# EAGLE design FSQCallTelemetry (EAGLE 7.6.0)
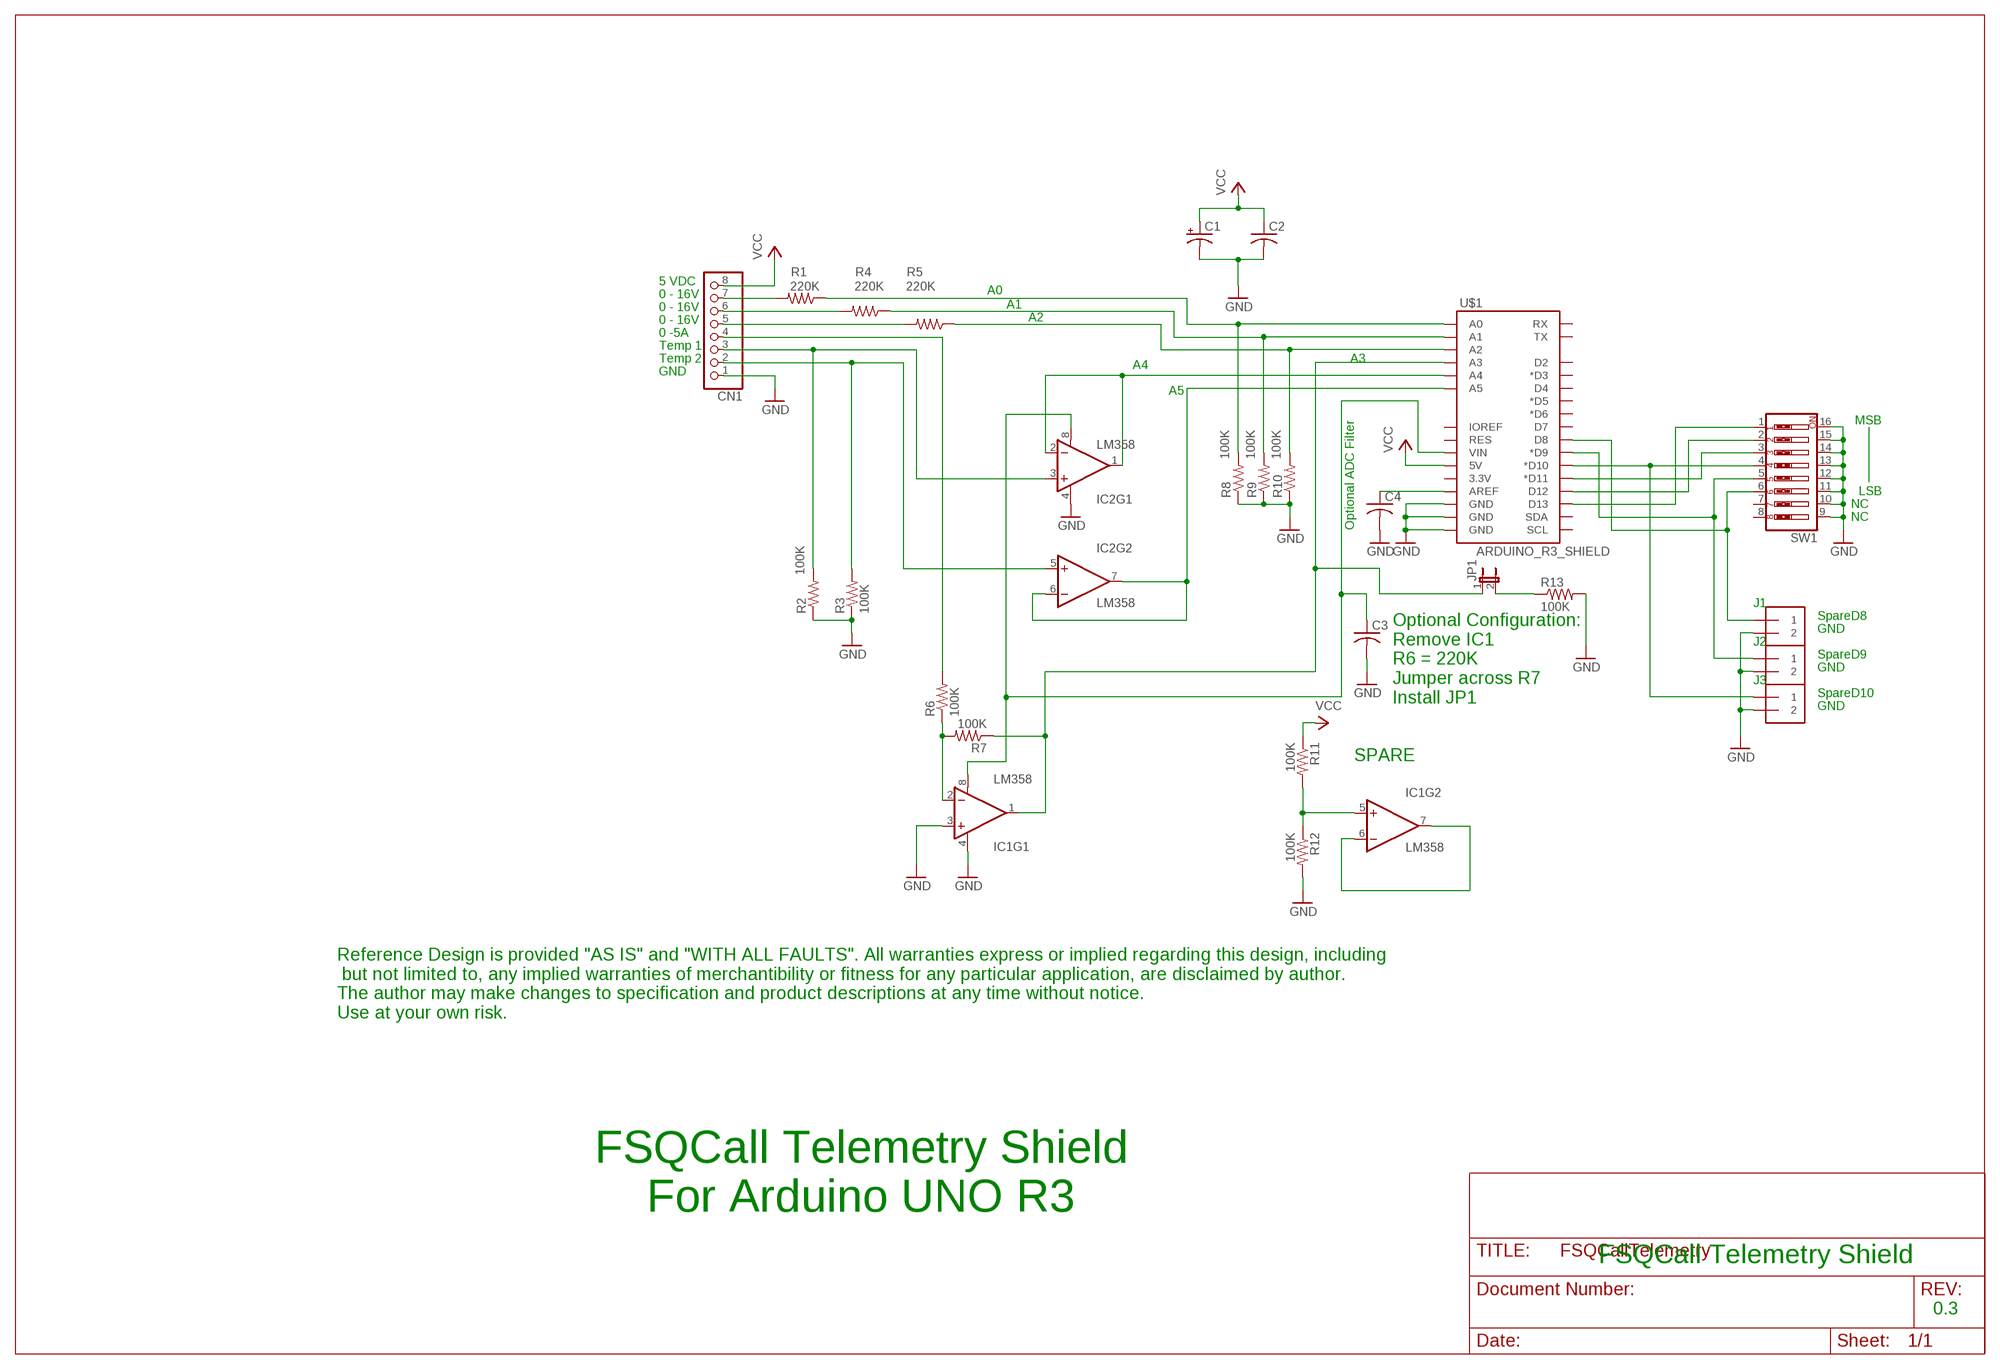
[diagram p0: schematic, sheet 1]

## Parts
C1  CPOL-USTT6D6  [TT5D6]
C2  C-US050-025X075  [C050-025X075]
C3  C-US050-025X075  [C050-025X075]
C4  C-US050-025X075  [C050-025X075]
CN1  PINHD-1X8BIG  [1X08-BIG]
IC1  LM358  [DIP08]
IC2  LM358  [DIP08]
J1  1X2-3.5MM  [1X2-3.5MM]
J2  1X2-3.5MM  [1X2-3.5MM]
J3  1X2-3.5MM  [1X2-3.5MM]
JP1  JP1E  [JP1]
R1  220K  R-US_0207/10  [0207/10]
R2  100K  R-US_0207/10  [0207/10]
R3  100K  R-US_0207/10  [0207/10]
R4  220K  R-US_0207/10  [0207/10]
R5  220K  R-US_0207/10  [0207/10]
R6  100K  R-US_0207/10  [0207/10]
R7  100K  R-US_0207/10  [0207/10]
R8  100K  R-US_0207/10  [0207/10]
R9  100K  R-US_0207/10  [0207/10]
R10  100K  R-US_0207/10  [0207/10]
R11  100K  R-US_0207/10  [0207/10]
R12  100K  R-US_0207/10  [0207/10]
R13  100K  R-US_0207/10  [0207/10]
SW1  SW_DIP-8  [DIPSWITCH-08]
U$1  ARDUINO_R3_SHIELD  [UNO_R3_SHIELD]

## Nets
GND: C1.- C2.2 C3.2 C4.2 CN1.1 IC1.3(+IN) IC1.4(V-) IC2.4(V-) J1.2 J2.2 J3.2 R2.1 R3.1 R8.1 R9.1 R10.1 R12.2 R13.2 SW1.9 SW1.10 SW1.11 SW1.12 SW1.13 SW1.14 SW1.15 SW1.16 U$1.GND@0(GND) U$1.GND@1(GND) U$1.GND@2(GND)
N$1: CN1.2 IC2.5(+IN) R3.2
N$2: IC1.2(-IN) R6.1 R7.2
N$3: CN1.3 IC2.3(+IN) R2.2
N$4: IC2.6(-IN) IC2.7(OUT) U$1.A5
N$5: CN1.4 R6.2
N$6: C3.1 IC1.8(V+) IC2.8(V+) U$1.VIN
N$7: C4.1 U$1.AREF
N$8: SW1.1 U$1.D13
N$9: CN1.7 R1.2
N$10: R1.1 R8.2 U$1.A0
N$11: R4.1 R9.2 U$1.A1
N$12: R5.1 R10.2 U$1.A2
N$13: SW1.2 U$1.D12
N$14: IC1.1(OUT) JP1.1 R7.1 U$1.A3
N$15: IC2.1(OUT) IC2.2(-IN) U$1.A4
N$16: SW1.3 U$1.D11(*D11)
N$17: J3.1 SW1.4 U$1.D10(*D10)
N$18: J2.1 SW1.5 U$1.D9(*D9)
N$19: IC1.5(+IN) R11.2 R12.1
N$20: IC1.6(-IN) IC1.7(OUT)
N$21: J1.1 SW1.6 U$1.D8
N$23: CN1.6 R4.2
N$24: CN1.5 R5.2
N$26: JP1.2 R13.1
VCC: C1.+ C2.1 CN1.8 R11.1 U$1.5V
Unconnected: SW1.7 SW1.8 U$1.3.3V U$1.D2 U$1.D3(*D3) U$1.D4 U$1.D5(*D5) U$1.D6(*D6) U$1.D7 U$1.IOREF U$1.RES U$1.RX U$1.SCL U$1.SDA U$1.TX

## Notes on the sheet
- 5 VDC
- A0
- 0 - 16V
- 0 - 16V | A1
- 0 - 16V | A2
- 0 -5A
- Temp 1
- Temp 2 | A3
- A4
- GND
- A5
- MSB
- LSB
- NC
- NC
- Optional ADC Filter
- J1
- SpareD8
- GND
- J2
- SpareD9
- GND
- J3
- SpareD10
- GND
- Optional Configuration:
  Remove IC1
  R6 = 220K
  Jumper across R7
  Install JP1
- SPARE
- Reference Design is provided "AS IS" and "WITH ALL FAULTS". All warranties express or implied regarding this design, including
   but not limited to, any implied warranties of merchantibility or fitness for any particular application, are disclaimed by author. 
  The author may make changes to specification and product descriptions at any time without notice. 
  Use at your own risk.
- FSQCall Telemetry Shield
      For Arduino UNO R3
- FSQCall Telemetry Shield
- 0.3

## Library data of the parts
C1 = adafruit:CPOL-US: POLARIZED CAPACITOR, American symbol
C2-C4 = rcl:C-US: CAPACITOR, American symbol
CN1 = adafruit:PINHD-1X8: PIN HEADER
IC1 IC2 = SparkFun-AnalogIC:LM358: Jellybean op-amp; PROD_ID: IC-09172
J1-J3 = adafruit:1X2: 3.5mm Terminal block http://www.ladyada.net/library/pcb/eaglelibrary.html
JP1 = jumper:JP1E: JUMPER
R1-R13 = resistor:R-US_: RESISTOR, American symbol
SW1 = SparkFun-Electromechanical:SW_DIP-8: DIP Switch 8 Position
U$1 = SparkFun-Boards:ARDUINO_R3_SHIELD: Shield form compatible with the Arduino Uno R3.

## Net classes
0 default: width 0.305 mm, drill 0.508 mm, clearance 0.254 mm

## Board
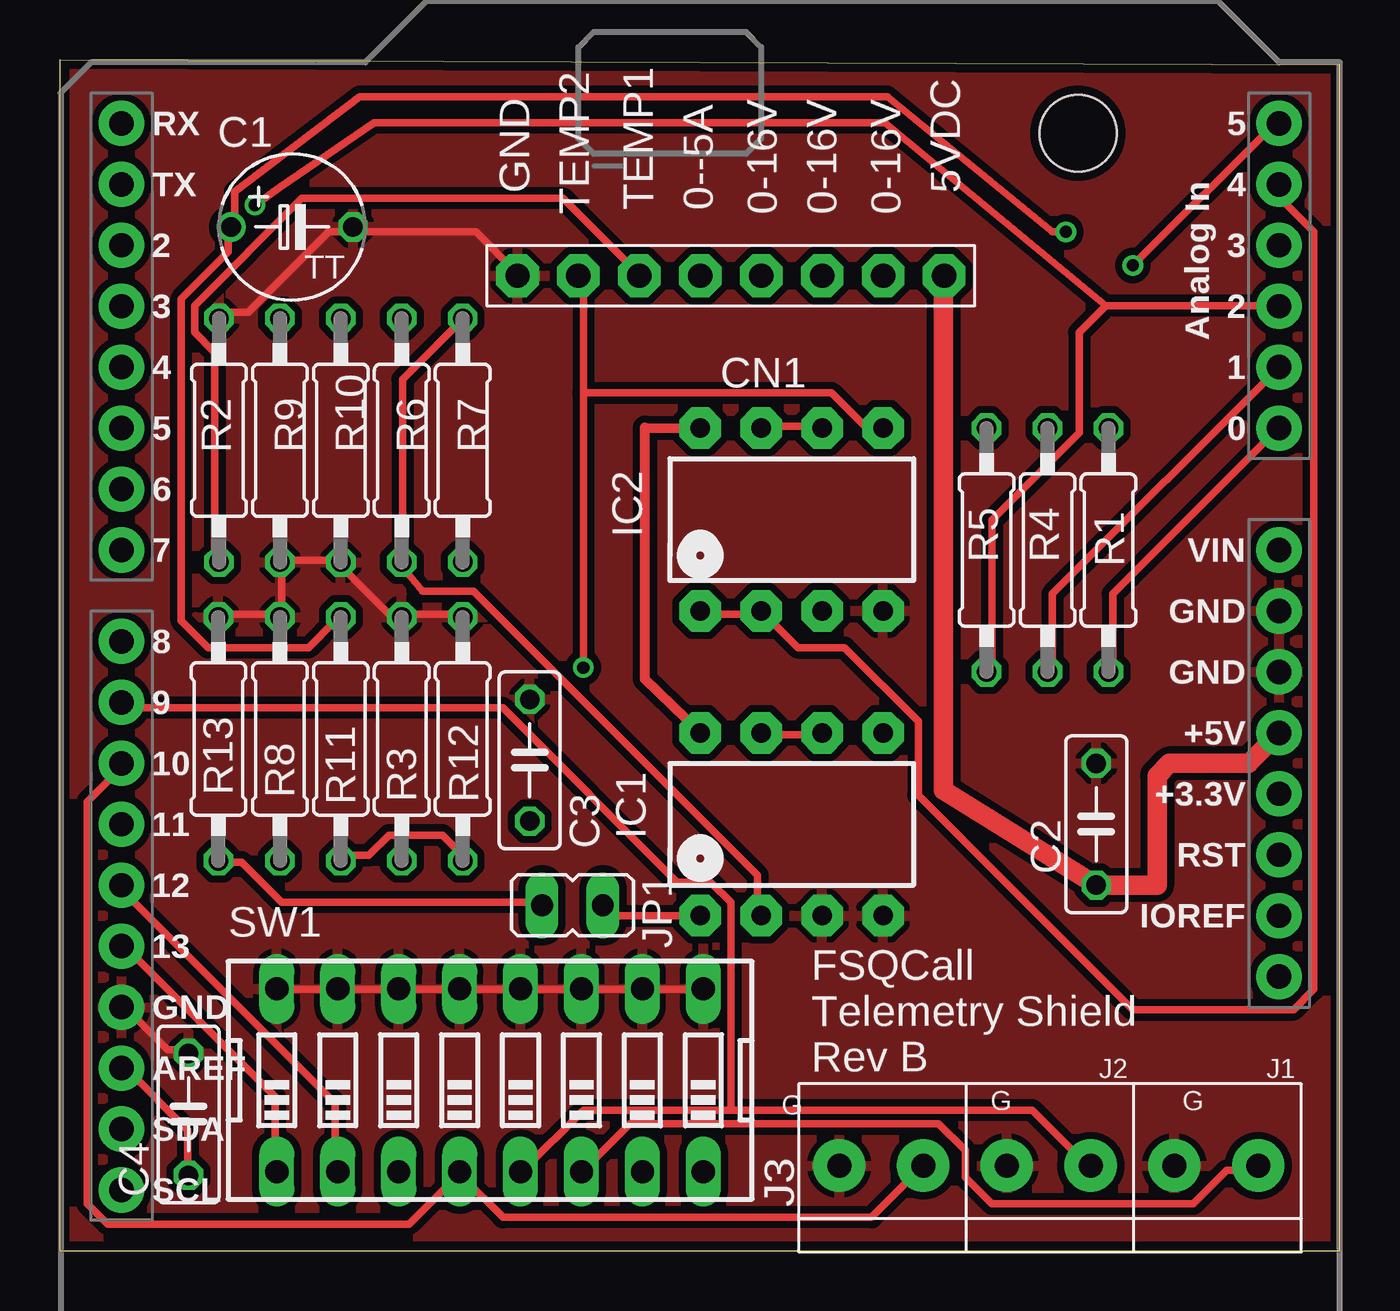
[diagram p1: board, top side]
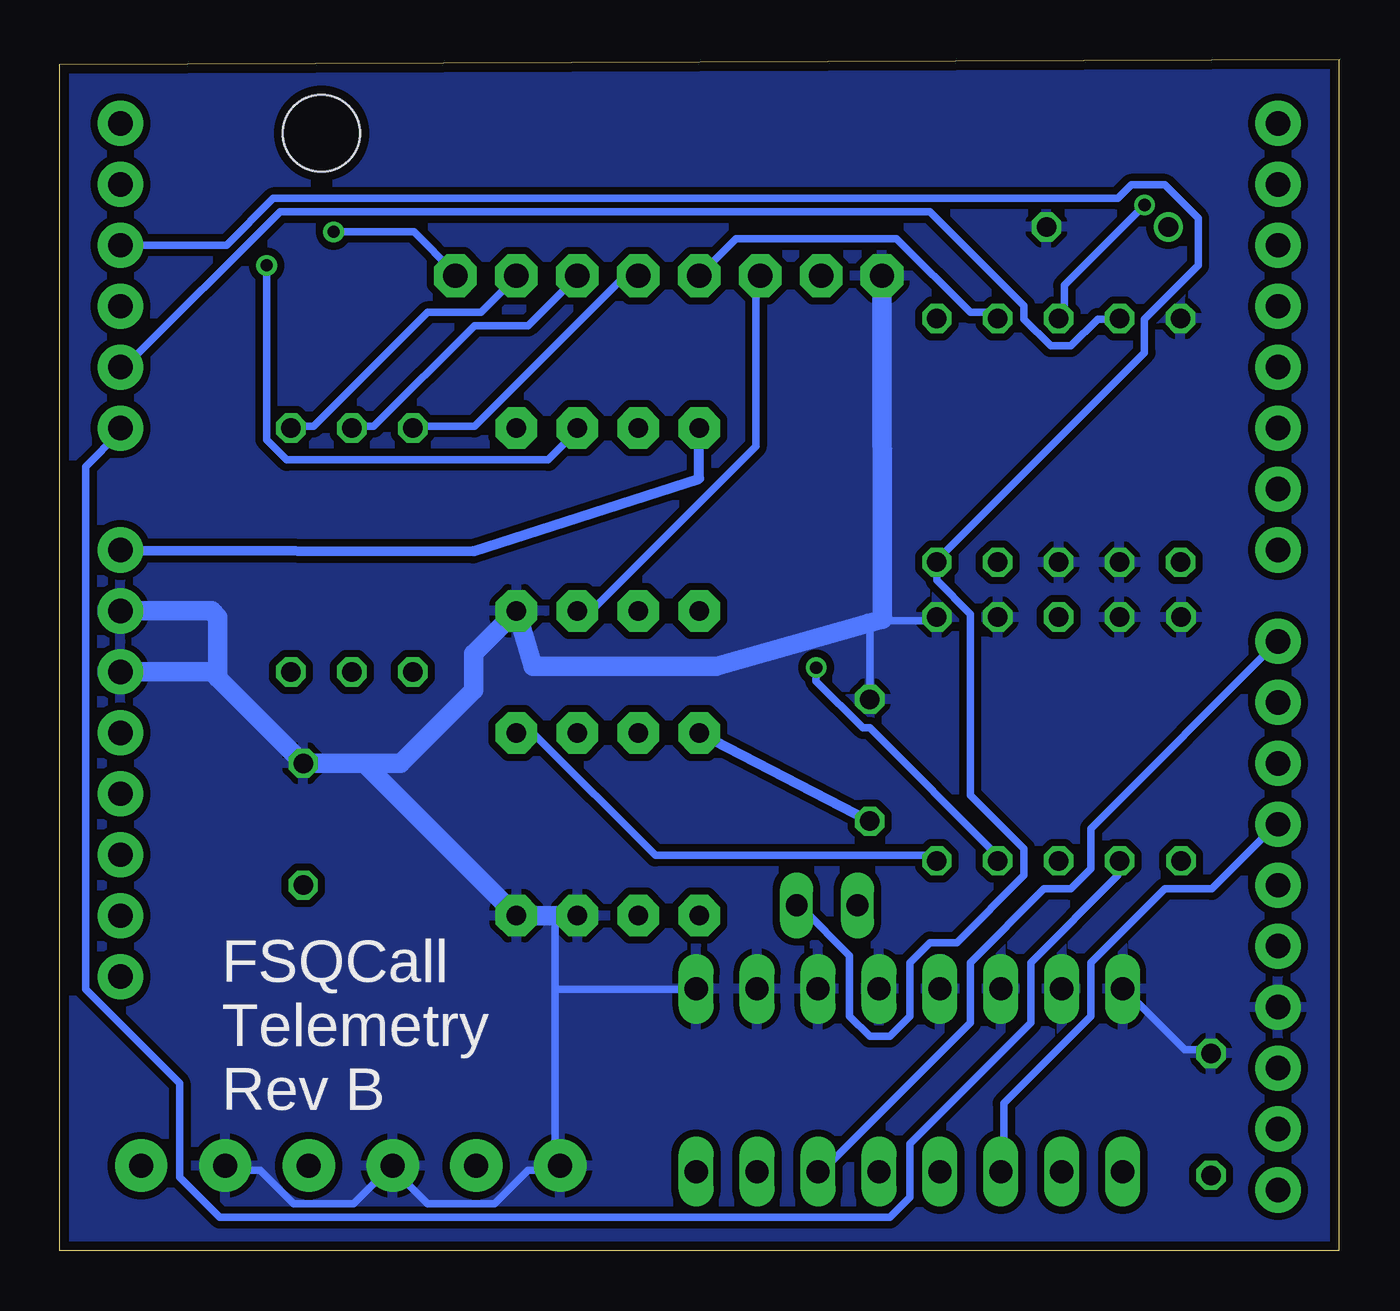
[diagram p2: board, bottom side, seen from below]

Size 53.35 x 49.63 mm. Coordinates in mm from the lower left corner, seen from the top.
Outline: 0.03,0 53.35,0 53.35,49.43
Outline: 53.35,49.43 53.35,49.45
Outline: 0,49.63 53.35,49.43
Outline: 0.01,0 0.01,49.63
Copper layers (1*16): Top 0.0356mm / dielectric 1.5011mm / Bottom 0.0356mm
Design rules "oshpark-2layer *": minimum track width 6mil, minimum drill 13mil, track to track 6mil, track to pad 6mil, pad to pad 6mil, via to via 6mil, smd to smd 6mil, copper to edge 15mil, drill to drill 6mil, minimum pad ring 7mil, minimum via ring 7mil, stop-mask expansion 2.5mil, vias tented up to drill 0mil, thermal gap 10mil
Holes 3.2 mm at 42.44,46.58

### Footprints (pad centres in the part's own frame; a part is rotated, then mirrored left to right if it is on the bottom)
TT5D6 = drill 0.813: + -2.54,0 | drill 0.813 octagon: - 2.54,0
C050-025X075 = drill 0.813 octagon: 1 -2.54,0; 2 2.54,0
1X08-BIG = drill 1.016 pad 1.778 octagon: 1 -8.89,0; 2 -6.35,0; 3 -3.81,0; 4 -1.27,0; 5 1.27,0; 6 3.81,0; 7 6.35,0; 8 8.89,0
DIP08 = drill 0.813 pad 1.727 octagon: 1 -3.81,-3.81; 2 -1.27,-3.81; 3 1.27,-3.81; 4 3.81,-3.81; 5 3.81,3.81; 6 1.27,3.81; 7 -1.27,3.81; 8 -3.81,3.81
1X2-3.5MM = drill 1 pad 2.184: 1 1.8,0; 2 -1.7,0
JP1 = drill 0.914 long: 1 0,-1.27; 2 0,1.27
0207/10 = drill 0.813 octagon: 1 -5.08,0; 2 5.08,0
DIPSWITCH-08 = drill 0.97 long: 1 -8.89,-3.81; 2 -6.35,-3.81; 3 -3.81,-3.81; 4 -1.27,-3.81; 5 1.27,-3.81; 6 3.81,-3.81; 7 6.35,-3.81; 8 8.89,-3.81; 9 8.89,3.81; 10 6.35,3.81; 11 3.81,3.81; 12 1.27,3.81; 13 -1.27,3.81; 14 -3.81,3.81; 15 -6.35,3.81; 16 -8.89,3.81
UNO_R3_SHIELD = drill 1.016 pad 1.88: 3.3V 50.8,26.67; 5V 50.8,29.21; A0 50.8,41.91; A1 50.8,44.45; A2 50.8,46.99; A3 50.8,49.53; A4 50.8,52.07; A5 50.8,54.61; AREF 2.54,15.24; D2 2.54,49.53; D3 2.54,46.99; D4 2.54,44.45; D5 2.54,41.91; D6 2.54,39.37; D7 2.54,36.83; D8 2.54,33.02; D9 2.54,30.48; D10 2.54,27.94; D11 2.54,25.4; D12 2.54,22.86; D13 2.54,20.32; GND@0 50.8,31.75; GND@1 50.8,34.29; GND@2 2.54,17.78; IOREF 50.8,21.59; NC 50.8,19.05; RES 50.8,24.13; RX 2.54,54.61; SCL 2.54,10.16; SDA 2.54,12.7; TX 2.54,52.07; VIN 50.8,36.83

### Placement (x,y rotation side)
C1  9.68,42.67 0 top
C2  43.21,17.78 90 top
C3  19.58,20.45 90 top
C4  5.36,5.69 90 top
CN1  27.97,40.64 0 top
IC1  30.51,17.78 0 top
IC2  30.51,30.48 0 top
J1  48.16,3.56 0 top
J2  41.17,3.56 0 top
J3  34.19,3.56 0 top
JP1  21.36,14.4 90 top
R1  43.71,29.21 90 top
R2  6.63,33.78 270 top
R3  14.25,21.34 270 top
R4  41.17,29.21 90 top
R5  38.63,29.21 90 top
R6  14.25,33.78 90 top
R7  16.79,33.78 90 top
R8  9.17,21.34 270 top
R9  9.17,33.78 90 top
R10  11.71,33.78 90 top
R11  11.71,21.34 270 top
R12  16.79,21.34 90 top
R13  6.6,21.34 90 top
SW1  17.93,7.11 0 top
U$1  0.03,-7.62 0 top

### Tracks (layer width: path | path; a pad name or v marks a point on that pad's centre or on a via)
GND
  Top 0.305: C4.2 5.33,8.38 4.5,8.38 2.82,10.06 U$1.GND@2 | SW1.9 26.57,10.9 24.33,10.9 SW1.10 24.05,10.9 21.82,10.9 SW1.11 21.54,10.9 19.3,10.9 SW1.12 19.02,10.9 16.79,10.9 SW1.13 16.51,10.9 14.27,10.9 SW1.14 14,10.9 11.76,10.9 SW1.15 11.48,10.9 9.25,10.9 SW1.16 | R2.1 6.73,39.12 7.85,39.12 11.2,42.47 12.04,42.47 C1.- 12.32,42.47 17.35,42.47 19.02,40.79 CN1.1 | R13.2 6.73,26.54 8.97,26.54 R8.1 9.25,26.54 9.25,28.5 R9.1 9.25,28.78 11.48,28.78 R10.1 11.76,28.5 14,26.26 R3.1 14.27,26.54 16.79,26.54 R12.2
  Bottom 0.305: C4.2 5.61,8.38 6.45,8.38 8.97,10.9 SW1.16 | J1.2 46.41,3.35 45.01,3.35 43.61,1.96 41.1,1.96 39.7,3.35 J2.2 39.42,3.35 38.02,1.96 35.23,1.96 33.83,3.35 32.72,3.35 J3.2 32.72,3.63 32.72,10.9 | C3.2 19.58,25.98 19.63,26.15 | 19.05,26.31 18.75,26.26 16.79,26.26 R12.2 | 32.72,13.97 32.72,10.9 | 32.72,10.9 26.85,10.9 SW1.9
  Bottom 0.813: U$1.GND@0 47.02,24.13 46.76,23.88 | 46.76,23.88 C2.2 | U$1.GND@1 47.02,26.67 46.76,26.42 46.76,23.88 | C2.2 40.67,20.32 IC1.4 32.72,13.97 IC1.3 | C2.2 39.14,20.32 36.09,23.37 36.09,24.89 IC2.4 33.63,24.36 25.98,24.36 19.63,26.15 19.05,26.31 CN1.1
  pour Bottom (isolate 0.305): 0.03,49.61 53.37,49.61 53.37,0 0.03,0
  pour Top (isolate 0.305): 0.03,49.61 53.37,49.61 53.37,0 0.03,0
N$1  (via drill 0.51)
  Top 0.305: 21.82,35.76 21.82,40.51 CN1.2 | 21.82,35.76 v21.82,24.31 | 21.82,35.76 32.16,35.76 33.55,34.37 34.11,34.37 IC2.5
  Bottom 0.305: v21.82,24.31 21.82,23.75 19.86,21.79 19.58,21.79 14.27,16.48 R3.2
N$2
  Top 0.305: R7.2 16.79,38.84 14.27,36.32 14.27,28.78 R6.1 14.27,28.5 15.11,27.48 17.25,27.48 29.08,15.65 29.08,13.97 IC1.2
N$3
  Top 0.305: R2.2 6.45,28.78 6.45,37.44 5.61,38.28 5.61,39.4 10.08,43.87 20.98,43.87 24.05,40.79 CN1.3
  Bottom 0.305: IC2.3 31.6,26.82 31.04,26.82 24.33,33.53 24.33,40.51 CN1.3
N$4  (via drill 0.51)
  Top 0.305: IC2.7 29.36,34.37 31.6,34.37 IC2.6 | v44.73,41.07 50.6,46.94 U$1.A5
  Bottom 0.305: v44.73,41.07 44.73,33.81 43.89,32.97 32.99,32.97 31.88,34.09 IC2.6
N$5
  Bottom 0.305: R6.2 14.27,39.12 15.39,39.12 18.47,42.19 25.17,42.19 26.57,40.79 CN1.4
N$6
  Top 0.406: IC1.8 24.38,23.82 24.38,34.31 IC2.8
  Bottom 0.406: U$1.VIN 36.12,29.16 26.7,32.18 IC2.8 | IC1.8 C3.1
N$7
  Top 0.305: C4.1 5.33,3.35 5.33,5.03 2.82,7.54 U$1.AREF
N$8
  Top 0.305: SW1.1 8.97,3.35 8.97,6.43 2.82,12.57 U$1.D13
N$9
  Bottom 0.305: R1.2 43.61,34.37 42.77,34.37 38.02,39.12 35.79,39.12 34.39,40.51 CN1.7
N$10
  Top 0.305: R1.1 43.89,24.31 43.89,27.38 50.6,34.09 U$1.A0
  Bottom 0.305: R8.2 9.25,16.2 9.25,15.65 12.88,12.01 12.88,9.5 17.91,4.47 17.91,2.23 18.75,1.4 46.69,1.4 48.36,3.07 48.36,6.99 52.27,10.9 52.27,32.69 50.88,34.09 U$1.A0
N$11
  Top 0.305: U$1.A1 41.38,27.38 41.38,24.31 R4.1
  Bottom 0.305: R9.2 9.25,38.84 10.08,38.84 11.2,37.72 12.04,37.72 13.16,38.84 13.16,39.4 17.07,43.31 44.17,43.31 50.6,36.88 U$1.A1
N$12  (via drill 0.51)
  Top 0.305: v8.13,43.59 9.14,44.3 13.11,47.02 34.39,47.02 43.61,39.4 | 43.61,39.4 50.6,39.4 U$1.A2 | 43.61,39.4 42.49,38.28 42.49,34.09 38.86,30.45 38.86,24.31 R5.1
  Bottom 0.305: v8.13,43.59 11.48,40.23 11.48,39.12 R10.2
N$13
  Top 0.305: SW1.2 11.48,3.35 11.48,6.15 2.54,15.09 U$1.D12
N$14
  Top 0.305: IC1.1 22.94,13.97 22.66,14.25 JP1.1
  Bottom 0.305: JP1.1 22.38,14.25 20.42,12.29 20.42,9.78 19.58,8.94 18.75,8.94 17.91,9.78 17.91,12.01 17.07,12.85 15.95,12.85 13.16,15.65 13.16,16.76 15.39,19 15.39,26.54 16.79,27.94 R7.1 16.79,28.78 8.13,37.44 8.13,38.84 5.89,41.07 5.89,43.03 7.29,44.42 8.69,44.42 9.25,43.87 44.45,43.87 46.41,41.91 U$1.A3
N$15
  Top 0.305: IC2.1 26.85,26.54 29.08,26.54 IC2.2 30.76,25.15 32.72,25.15 35.79,22.07 35.79,19 44.73,10.06 51.44,10.06 52.27,10.9 52.27,42.47 50.88,43.87 50.88,44.42 U$1.A4
N$16
  Bottom 0.305: SW1.3 14,3.35 14,6.15 10.36,9.78 10.36,12.01 7.29,15.09 5.33,15.09 2.82,17.6 U$1.D11
N$17
  Top 0.305: J3.1 35.79,3.35 33.83,1.4 18.47,1.4 16.79,3.07 SW1.4 16.51,3.07 14.55,1.12 1.98,1.12 1.14,1.96 1.14,18.72 2.54,20.12 U$1.D10
N$18
  Top 0.305: 27.97,5.87 40.54,5.87 42.77,3.63 J2.1 | 27.97,5.87 21.82,5.87 19.3,3.35 SW1.5 | 27.97,5.87 27.97,14.53 27.13,15.37 25.73,15.37 18.47,22.63 2.82,22.63 U$1.D9
N$19
  Top 0.305: R11.2 11.76,16.48 12.88,16.48 13.72,17.32 15.95,17.32 16.79,16.48 R12.1
  Bottom 0.305: IC1.5 34.11,21.51 33.55,21.51 28.52,16.48 16.79,16.48 R12.1
N$20
  Top 0.305: IC1.7 29.36,21.51 31.6,21.51 IC1.6
N$21
  Top 0.305: J1.1 49.76,3.35 48.64,3.35 47.24,1.96 38.86,1.96 37.74,3.07 37.74,4.19 36.63,5.31 23.77,5.31 21.82,3.35 SW1.6
  Bottom 0.305: U$1.D8 10.36,17.6 10.36,15.93 11.2,15.09 12.32,15.09 15.39,12.01 15.39,9.5 21.54,3.35 SW1.6
N$23
  Bottom 0.305: R4.2 41.1,34.37 40.26,34.37 36.07,38.56 33.83,38.56 31.88,40.51 CN1.6
N$24
  Bottom 0.305: R5.2 38.58,34.37 36.07,34.37 29.92,40.51 29.36,40.51 CN1.5
N$26
  Top 0.305: R13.1 6.73,16.2 7.57,16.2 9.25,14.53 19.86,14.53 JP1.2
VCC  (via drill 0.51)
  Top 0.305: R11.1 11.48,26.26 10.36,25.15 6.17,25.15 5.05,26.26 5.05,39.67 7.01,41.63 7.01,42.47 C1.+ 7.29,42.75 7.29,44.15 12.5,48.11 34.49,48.11 41.38,42.47 v41.94,42.47
  Top 0.813: U$1.5V 49.56,20.32 46.25,20.32 45.75,19.81 45.75,15.24 C2.1 36.83,19.2 36.83,40.64 CN1.8
  Bottom 0.305: v41.94,42.47 38.58,42.47 36.91,40.79 CN1.8

### Text on the board
tPlace: GND | 5VDC | TEMP2 | TEMP1 | 0--5A | 0-16V | 0-16V | 0-16V | FSQCall / Telemetry Shield / Rev B | G | G | G
bPlace: FSQCall / Telemetry / Rev B